# EAGLE design bbstghs (EAGLE 5.09)
POLLIN: AC-1205G; REICHELT: TASTER 3301
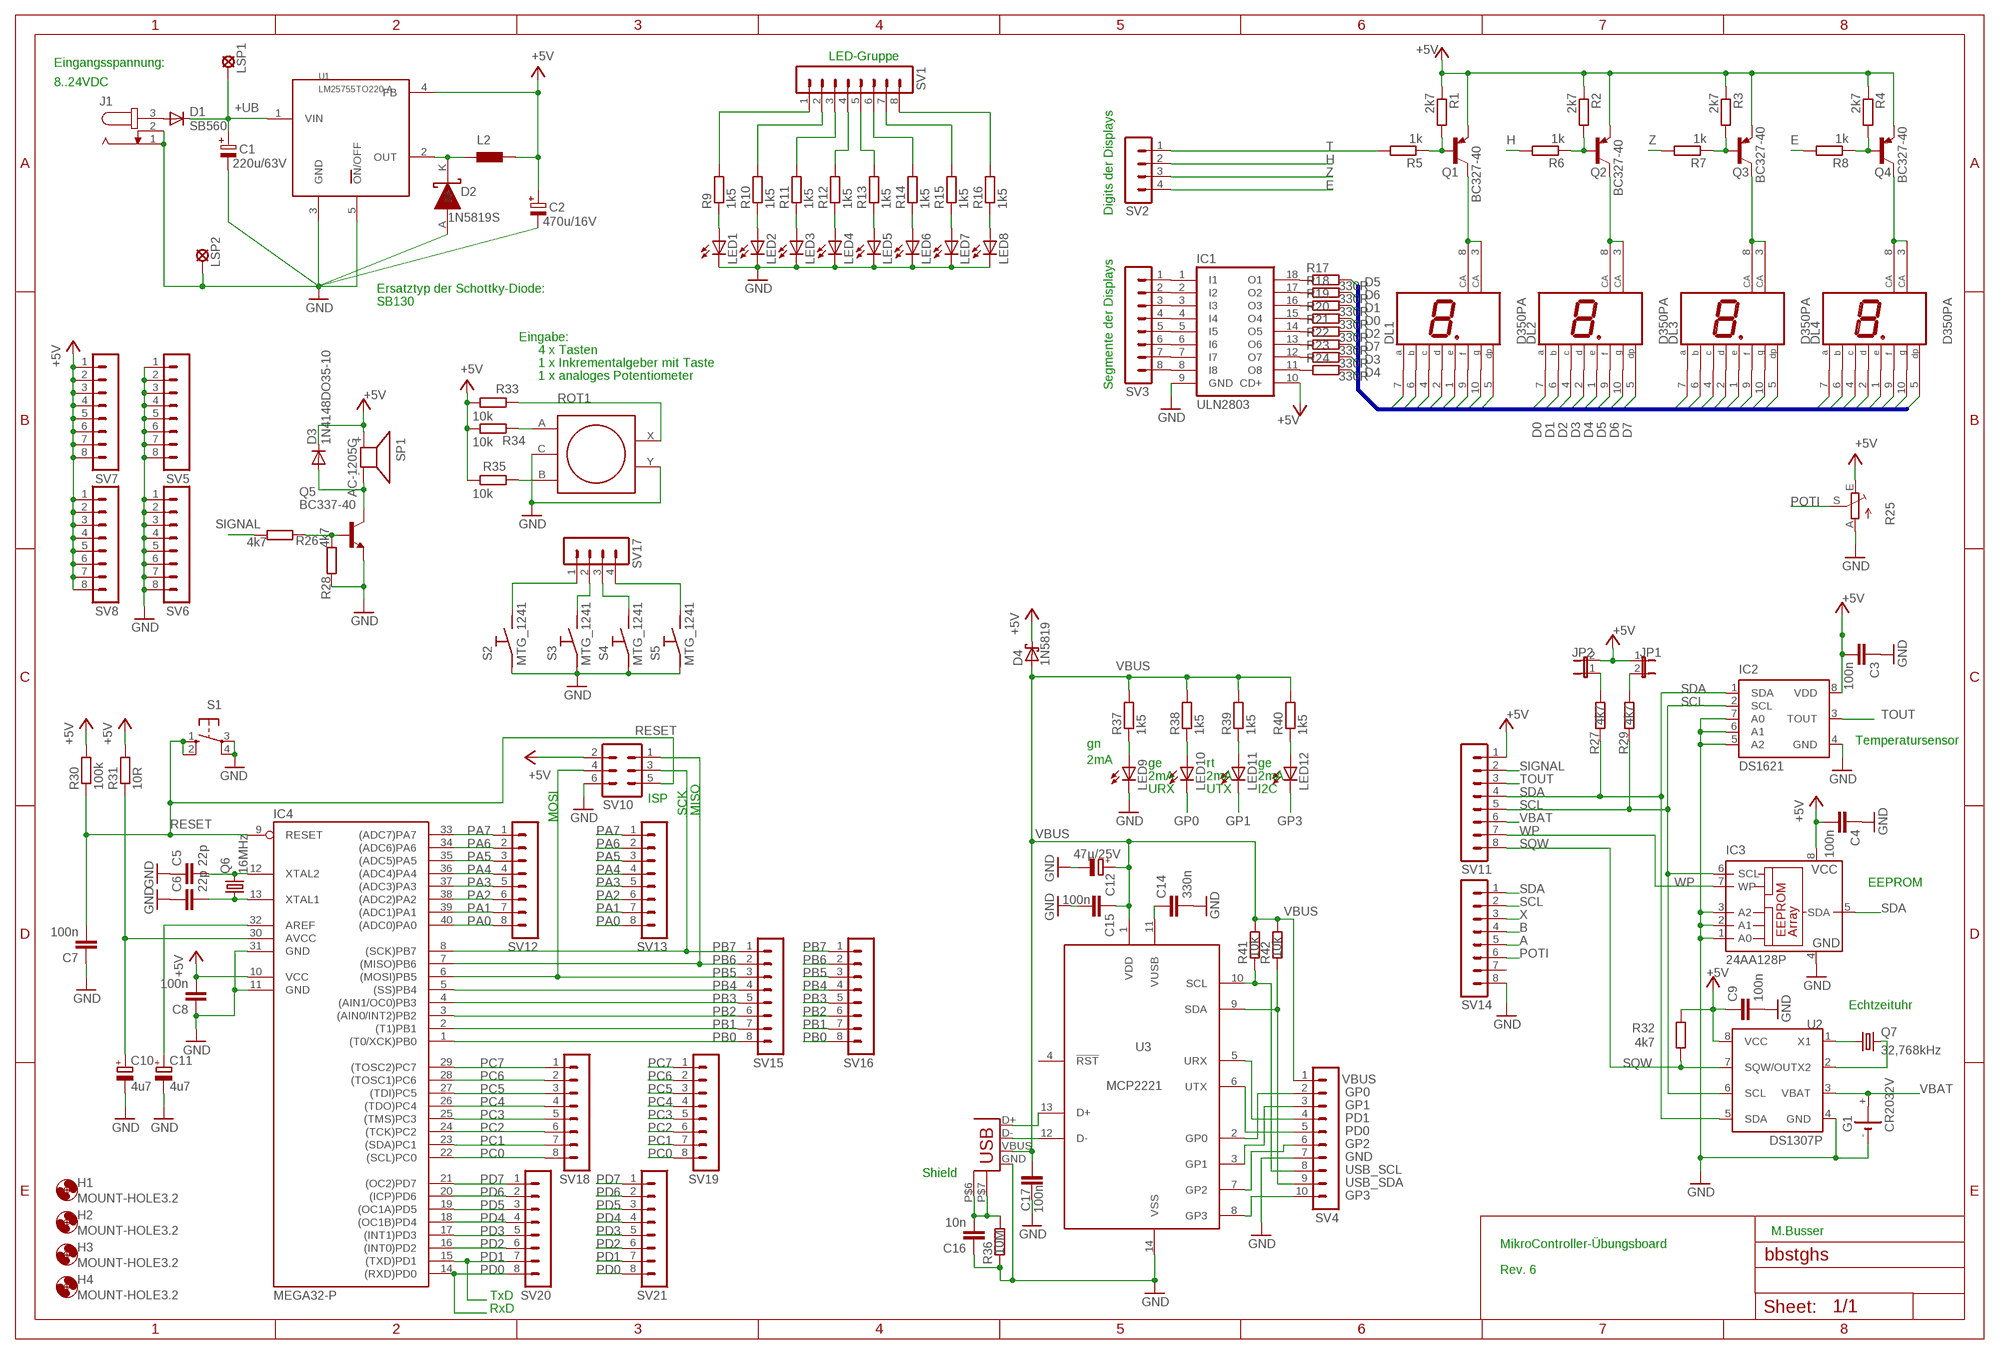
[diagram p0: schematic, sheet 1]

## Parts
C1  220u/63V  E5-10,5  [E5-10,5]
C2  470u/16V  E5-10,5  [E5-10,5]
C3  100n  C-EU050-025X075  [C050-025X075]
C4  100n  C-EU050-025X075  [C050-025X075]
C5  22p  C-EU050-025X075  [C050-025X075]
C6  22p  C-EU050-025X075  [C050-025X075]
C7  100n  C-EU050-025X075  [C050-025X075]
C8  100n  C-EU050-025X075  [C050-025X075]
C9  100n  C-EU050-025X075  [C050-025X075]
C10  4u7  CPOL-EUE2-5  [E2-5]
C11  4u7  CPOL-EUE2-5  [E2-5]
C12  47µ/25V  CPOL-EUE2-5  [E2-5]
C14  330n  C-EU050-030X075  [C050-030X075]
C15  100n  C-EU050-030X075  [C050-030X075]
C16  10n  C-EU050-030X075  [C050-030X075]
C17  100n  C-EU050-030X075  [C050-030X075]
C18  USB_SHIELED  [USB-MB-H-SHIELD]
D1  SB560  SB320  [DO201-15]
D2  1N5819S  [SOD-81]
D3  1N4148DO35-10  [DO35-10]
D4  1N5819  1N581  [DO41-10]
DL1  D350PA  [HDSP-M]
DL2  D350PA  [HDSP-M]
DL3  D350PA  [HDSP-M]
DL4  D350PA  [HDSP-M]
G1  CR2032V  [CR2032V]
H1  MOUNT-HOLE3.2  [3,2]
H2  MOUNT-HOLE3.2  [3,2]
H3  MOUNT-HOLE3.2  [3,2]
H4  MOUNT-HOLE3.2  [3,2]
IC1  ULN2803  ULN2803A  [DIL18]
IC2  DS1621  [DIL08]
IC3  24AA128P  [DIL8]
IC4  MEGA32-P  [DIL40]
J1  JACK-PLUG1  [SPC4078]
JP1  JP1E  [JP1]
JP2  JP1E  [JP1]
L2  PISR  [PISR]
LED1  LED3MM  [LED3MM]
LED2  LED3MM  [LED3MM]
LED3  LED3MM  [LED3MM]
LED4  LED3MM  [LED3MM]
LED5  LED3MM  [LED3MM]
LED6  LED3MM  [LED3MM]
LED7  LED3MM  [LED3MM]
LED8  LED3MM  [LED3MM]
LED9  LED3MM  [LED3MM]
LED10  LED3MM  [LED3MM]
LED11  LED3MM  [LED3MM]
LED12  LED3MM  [LED3MM]
LSP1  LSP10  [LSP10]
LSP2  LSP10  [LSP10]
Q1  BC327-40  [TO92-EBC]
Q2  BC327-40  [TO92-EBC]
Q3  BC327-40  [TO92-EBC]
Q4  BC327-40  [TO92-EBC]
Q5  BC337-40  [TO92]
Q6  16MHz  CRYSTALHC49U-V  [HC49U-V]
Q7  32,768kHz  CRYSTALTC26V  [TC26V]
R1  2k7  R-EU_0207/10  [0207/10]
R2  2k7  R-EU_0207/10  [0207/10]
R3  2k7  R-EU_0207/10  [0207/10]
R4  2k7  R-EU_0207/10  [0207/10]
R5  1k  R-EU_0207/10  [0207/10]
R6  1k  R-EU_0207/10  [0207/10]
R7  1k  R-EU_0207/10  [0207/10]
R8  1k  R-EU_0207/10  [0207/10]
R9  1k5  R-EU_0207/10  [0207/10]
R10  1k5  R-EU_0207/10  [0207/10]
R11  1k5  R-EU_0207/10  [0207/10]
R12  1k5  R-EU_0207/10  [0207/10]
R13  1k5  R-EU_0207/10  [0207/10]
R14  1k5  R-EU_0207/10  [0207/10]
R15  1k5  R-EU_0207/10  [0207/10]
R16  1k5  R-EU_0207/10  [0207/10]
R17  330R  R-EU_0207/10  [0207/10]
R18  330R  R-EU_0207/10  [0207/10]
R19  330R  R-EU_0207/10  [0207/10]
R20  330R  R-EU_0207/10  [0207/10]
R21  330R  R-EU_0207/10  [0207/10]
R22  330R  R-EU_0207/10  [0207/10]
R23  330R  R-EU_0207/10  [0207/10]
R24  330R  R-EU_0207/10  [0207/10]
R25  TRIM_EU-PT10  [PT-10]
R26  4k7  R-EU_0207/10  [0207/10]
R27  4k7  R-EU_0207/10  [0207/10]
R28  4k7  R-EU_0207/10  [0207/10]
R29  4k7  R-EU_0207/10  [0207/10]
R30  100k  R-EU_0207/10  [0207/10]
R31  10R  R-EU_0207/10  [0207/10]
R32  4k7  R-EU_0207/10  [0207/10]
R33  10k  R-EU_0207/10  [0207/10]
R34  10k  R-EU_0207/10  [0207/10]
R35  10k  R-EU_0207/10  [0207/10]
R36  10M  R-EU_0207/10  [0207/10]
R37  1k5  R-EU_0207/10  [0207/10]
R38  1k5  R-EU_0207/10  [0207/10]
R39  1k5  R-EU_0207/10  [0207/10]
R40  1k5  R-EU_0207/10  [0207/10]
R41  10k  R-EU_0207/10  [0207/10]
R42  10k  R-EU_0207/10  [0207/10]
ROT1  STEC12E08  [EC12E24244]
S1  10-XX  [B3F-10XX]
S2  MTG_1241  [SCHURTER_MTG]
S3  MTG_1241  [SCHURTER_MTG]
S4  MTG_1241  [SCHURTER_MTG]
S5  MTG_1241  [SCHURTER_MTG]
SP1  AC-1205G  KSS1201  [KSS1201]
SV1  MA08-1  [MA08-1]
SV2  MA04-1  [MA04-1]
SV3  MA08-1  [MA08-1]
SV4  MA10-1  [MA10-1]
SV5  MA08-1  [MA08-1]
SV6  MA08-1  [MA08-1]
SV7  MA08-1  [MA08-1]
SV8  MA08-1  [MA08-1]
SV10  ML6  [ML6]
SV11  MA08-1  [MA08-1]
SV12  MA08-1  [MA08-1]
SV13  MA08-1  [MA08-1]
SV14  MA08-1  [MA08-1]
SV15  MA08-1  [MA08-1]
SV16  MA08-1  [MA08-1]
SV17  MA04-1  [MA04-1]
SV18  MA08-1  [MA08-1]
SV19  MA08-1  [MA08-1]
SV20  MA08-1  [MA08-1]
SV21  MA08-1  [MA08-1]
U1  LM25755TO220-A  [L200]
U2  DS1307P  [DIL08]
U3  MCP2221  [DIL14]

## Nets
+5V: C2.+ C3.2 C4.2 C8.2 C9.1 D3.C D4.C IC1.10(CD+) IC2.8(VDD) IC3.8(VCC) IC4.10(VCC) JP1.1 JP2.2 L2.P$2 Q1.E Q2.E Q3.E Q4.E R1.1 R2.1 R3.1 R4.1 R25.E R30.2 R31.2 R32.2 R33.2 R34.2 R35.2 SP1.+ SV7.1 SV7.2 SV7.3 SV7.4 SV7.5 SV7.6 SV7.7 SV7.8 SV8.1 SV8.2 SV8.3 SV8.4 SV8.5 SV8.6 SV8.7 SV8.8 SV10.2 SV11.1 U1.4(FB) U2.8(VCC)
+UB: C1.+ D1.C LSP1.MP U1.1(VIN)
A: R34.1 ROT1.A SV14.5
B: R35.1 ROT1.B SV14.4
D0: DL1.7(A) DL2.7(A) DL3.7(A) DL4.7(A) R20.2
D1: DL1.6(B) DL2.6(B) DL3.6(B) DL4.6(B) R19.2
D2: DL1.4(C) DL2.4(C) DL3.4(C) DL4.4(C) R21.2
D3: DL1.2(D) DL2.2(D) DL3.2(D) DL4.2(D) R23.2
D4: DL1.1(E) DL2.1(E) DL3.1(E) DL4.1(E) R24.2
D5: DL1.9(F) DL2.9(F) DL3.9(F) DL4.9(F) R17.2
D6: DL1.10(G) DL2.10(G) DL3.10(G) DL4.10(G) R18.2
D7: DL1.5(DP) DL2.5(DP) DL3.5(DP) DL4.5(DP) R22.2
E: R8.2 SV2.4
GND: C1.- C2.- C3.1 C4.1 C5.1 C6.1 C7.1 C8.1 C9.2 C10.- C11.- C12.- C14.2 C15.2 C16.1 C17.1 C18.GND D2.A G1.- IC1.9(GND) IC2.4(GND) IC2.5(A2) IC2.6(A1) IC2.7(A0) IC3.1(A0) IC3.2(A1) IC3.3(A2) IC3.4(GND) IC4.11(GND) IC4.31(GND) J1.1 J1.2 LED1.K(C) LED2.K(C) LED3.K(C) LED4.K(C) LED5.K(C) LED6.K(C) LED7.K(C) LED8.K(C) LED9.K(C) LSP2.MP Q5.1(E) R25.A R28.1 R36.2 ROT1.C ROT1.Y S1.3(P) S1.4(P1) S2.P$1(C) S3.P$1(C) S4.P$1(C) S5.P$1(C) SV4.7 SV5.1 SV5.2 SV5.3 SV5.4 SV5.5 SV5.6 SV5.7 SV5.8 SV6.1 SV6.2 SV6.3 SV6.4 SV6.5 SV6.6 SV6.7 SV6.8 SV10.6 SV14.8 U1.3(GND) U1.5(ON/OFF) U2.4(GND) U3.14(VSS)
GP0: LED10.K(C) SV4.2 U3.2(GP0)
GP1: LED11.K(C) SV4.3 U3.3(GP1)
GP2: SV4.6 U3.7(GP2)
GP3: LED12.K(C) SV4.10 U3.8(GP3)
H: R6.2 SV2.2
N$1: C5.2 IC4.12(XTAL2) Q6.2
N$2: C6.2 IC4.13(XTAL1) Q6.1
N$3: C10.+ IC4.30(AVCC) R31.1
N$4: C11.+ IC4.32(AREF)
N$5: R14.2 SV1.6
N$6: LED1.A R9.1
N$7: LED2.A R10.1
N$8: LED3.A R11.1
N$9: LED4.A R12.1
N$10: LED5.A R13.1
N$11: LED6.A R14.1
N$12: LED7.A R15.1
N$13: LED8.A R16.1
N$14: R16.2 SV1.8
N$15: R12.2 SV1.4
N$16: R11.2 SV1.3
N$17: R10.2 SV1.2
N$18: R13.2 SV1.5
N$19: R15.2 SV1.7
N$20: R9.2 SV1.1
N$21: S2.P$2(NO) SV17.1
N$22: S5.P$2(NO) SV17.4
N$23: S4.P$2(NO) SV17.3
N$24: S3.P$2(NO) SV17.2
N$25: DL4.3(CA) DL4.8(CA) Q4.C
N$26: DL3.3(CA) DL3.8(CA) Q3.C
N$27: DL2.3(CA) DL2.8(CA) Q2.C
N$28: DL1.3(CA) DL1.8(CA) Q1.C
N$29: Q4.B R4.2 R8.1
N$30: Q3.B R3.2 R7.1
N$31: Q2.B R2.2 R6.1
N$32: Q1.B R1.2 R5.1
N$33: IC1.18(O1) R17.1
N$34: IC1.17(O2) R18.1
N$35: IC1.16(O3) R19.1
N$36: IC1.15(O4) R20.1
N$37: IC1.14(O5) R21.1
N$38: IC1.13(O6) R22.1
N$39: IC1.12(O7) R23.1
N$40: IC1.11(O8) R24.1
N$41: D3.A Q5.3(C) SP1.-
N$42: D2.K L2.P$1 U1.2(OUT)
N$43: C18.D- U3.12(D-)
N$44: C18.D+ U3.13(D+)
N$45: C14.1 U3.11(VUSB)
N$46: C16.2 C18.P$6(SHIELD1) C18.P$7(SHIELD) R36.1
N$47: IC1.1(I1) SV3.1
N$48: IC1.2(I2) SV3.2
N$49: IC1.3(I3) SV3.3
N$50: IC1.4(I4) SV3.4
N$51: LED9.A R37.1
N$52: LED10.A R38.1
N$53: LED11.A R39.1
N$54: LED12.A R40.1
N$55: IC1.5(I5) SV3.5
N$56: IC1.6(I6) SV3.6
N$57: IC1.7(I7) SV3.7
N$58: IC1.8(I8) SV3.8
N$59: JP2.1 R27.2
N$60: JP1.2 R29.2
N$61: Q7.1 U2.1(X1)
N$62: Q7.2 U2.2(X2)
N$65: Q5.2(B) R26.1 R28.2
N$88: D1.A J1.3
PA0: IC4.40((ADC0)PA0) SV12.8 SV13.8
PA1: IC4.39((ADC1)PA1) SV12.7 SV13.7
PA2: IC4.38((ADC2)PA2) SV12.6 SV13.6
PA3: IC4.37((ADC3)PA3) SV12.5 SV13.5
PA4: IC4.36((ADC4)PA4) SV12.4 SV13.4
PA5: IC4.35((ADC5)PA5) SV12.3 SV13.3
PA6: IC4.34((ADC6)PA6) SV12.2 SV13.2
PA7: IC4.33((ADC7)PA7) SV12.1 SV13.1
PB0: IC4.1((T0/XCK)PB0) SV15.8 SV16.8
PB1: IC4.2((T1)PB1) SV15.7 SV16.7
PB2: IC4.3((AIN0/INT2)PB2) SV15.6 SV16.6
PB3: IC4.4((AIN1/OC0)PB3) SV15.5 SV16.5
PB4: IC4.5((SS)PB4) SV15.4 SV16.4
PB5: IC4.6((MOSI)PB5) SV10.4 SV15.3 SV16.3
PB6: IC4.7((MISO)PB6) SV10.1 SV15.2 SV16.2
PB7: IC4.8((SCK)PB7) SV10.3 SV15.1 SV16.1
PC0: IC4.22((SCL)PC0) SV18.8 SV19.8
PC1: IC4.23((SDA)PC1) SV18.7 SV19.7
PC2: IC4.24((TCK)PC2) SV18.6 SV19.6
PC3: IC4.25((TMS)PC3) SV18.5 SV19.5
PC4: IC4.26((TDO)PC4) SV18.4 SV19.4
PC5: IC4.27((TDI)PC5) SV18.3 SV19.3
PC6: IC4.28((TOSC1)PC6) SV18.2 SV19.2
PC7: IC4.29((TOSC2)PC7) SV18.1 SV19.1
PD0: IC4.14((RXD)PD0) SV4.5 SV20.8 SV21.8 U3.6(UTX)
PD1: IC4.15((TXD)PD1) SV4.4 SV20.7 SV21.7 U3.5(URX)
PD2: IC4.16((INT0)PD2) SV20.6 SV21.6
PD3: IC4.17((INT1)PD3) SV20.5 SV21.5
PD4: IC4.18((OC1B)PD4) SV20.4 SV21.4
PD5: IC4.19((OC1A)PD5) SV20.3 SV21.3
PD6: IC4.20((ICP)PD6) SV20.2 SV21.2
PD7: IC4.21((OC2)PD7) SV20.1 SV21.1
POTI: R25.S SV14.6
RESET: C7.2 IC4.9(RESET) R30.1 S1.1(S) S1.2(S1) SV10.5
SCL: IC2.2(SCL) IC3.6(SCL) R29.1 SV11.5 SV14.2 U2.6(SCL)
SDA: IC2.1(SDA) IC3.5(SDA) R27.1 SV11.4 SV14.1 U2.5(SDA)
SIGNAL: R26.2 SV11.2
SQW: R32.1 SV11.8 U2.7(SQW/OUT)
T: R5.2 SV2.1
TOUT: IC2.3(TOUT) SV11.3
USB_SCL: R41.1 SV4.8 U3.10(SCL)
USB_SDA: R42.1 SV4.9 U3.9(SDA)
VBAT: G1.+ SV11.6 U2.3(VBAT)
VBUS: C12.+ C15.1 C17.2 C18.VBUS D4.A R37.2 R38.2 R39.2 R40.2 R41.2 R42.2 SV4.1 U3.1(VDD)
WP: IC3.7(WP) SV11.7
X: R33.1 ROT1.X SV14.3
Z: R7.2 SV2.3
Unconnected: G1.+@1(+) SV14.7 U3.4(!RST)

## Buses
B$1

## Notes on the sheet
- LED-Gruppe
- Eingangsspannung:
- 8..24VDC
- Digits der Displays
- Ersatztyp der Schottky-Diode:
- SB130
- Eingabe:
- 4 x Tasten
- 1 x Inkrementalgeber mit Taste
- 1 x analoges Potentiometer
- Segmente der Displays
- gn | Temperatursensor
- 2mA | ge | rt | ge
- 2mA | 2mA | 2mA
- URX | UTX | I2C
- ISP
- SCK | MISO
- MOSI
- EEPROM
- Echtzeituhr
- Shield
- M.Busser
- MikroController-Übungsboard
- Rev. 6
- TxD
- RxD

## Library data of the parts
C1 C2 = polcap:E5-10,5
C3-C9 C14-C17 = bbstghs:C-EU: CAPACITOR, European symbol
C10-C12 = bbstghs:CPOL-EU: POLARIZED CAPACITOR, European symbol
C18 = con-usb:USB_SHIELED
D1 = bbstghs:SB320: DIODE barrier rectifier, 3 A (Fairchild)
D2 = misc:1N5819
D3 = bbstghs:1N4148: DIODE high speed (Philips)
D4 = bbstghs:1N581*: 1.0A SCHOTTKY BARRIER RECTIFIER Source: http://www.diodes.com/datasheets/ds23001.pdf
DL1-DL4 = ibb:D350PA
G1 = battery:CR2032V: LI BATTERY Varta
H1-H4 = holes:MOUNT-HOLE: MOUNTING HOLE with drill center marker
IC1 = uln-udn:ULN2803A: DRIVER ARRAY
IC2 = maxim:DS1621: Digital Thermometer and Thermostat Source: http://pdfserv.maxim-ic.com/en/ds/DS1621.pdf
IC3 = microchip:24*: Serial EEPROM I2C
IC4 = atmel:MEGA32-P: MICROCONTROLLER 32 Kbytes FLASH 2 Kbytes SRAM 1 Kbytes EEPROM USART 8-channel 10 bit ADC Source: www.atmel.com .. doc2503.pdf
J1 = bbstghs:JACK-PLUG: DC POWER JACK Power Jack, DC, Right Angle, Through Hole, Rated 5A at 16VDC, PC Terminals Distributor: Farnell (www.Farnell.de) Drawing: 84N1161.pdf / 84N1162.pdf Manufacturer: SPC Technology (www.spctechnology.com) Type: SPC4077 / SPC 4078
JP1 JP2 = bbstghs:JP1E: JUMPER
L2 = inductor-fastron:PISR
LED1-LED12 = bbstghs:LED: LED OSRAM: - CHIPLED LG R971, LG N971, LY N971, LG Q971, LY Q971, LO R971, LY R971 LH N974, LH R974 LS Q976, LO Q976, LY Q976 LO Q996 - Hyper CHIPLED LW Q18S LB Q993, LB Q99A, LB R99A - SideLED LS A670, LO A670, LY A670, LG A670, LP A670 LB A673, LV A673, LT A673, LW A673 LH A674 LY A675 LS A676, LA A676, LO A676, LY A676, LW A676 LS A679, LY A679, LG A679 - Hyper Micro SIDELED® LS Y876, LA Y876, LO Y876, LY Y876 LT Y87S - SmartLED LW L88C, LW L88S LB L89C, LB L89S, LG L890 LS L89K, LO L89K, LY L89K LS L896, LA L896, LO L896, LY L896 - TOPLED LS T670, LO T670, LY T670, LG T670, LP T670 LSG T670, LSP T670, LSY T670, LOP T670, LYG T670 LG T671, LOG T671, LSG T671 LB T673, LV T673, LT T673, LW T673 LH T674 LS T676, LA T676, LO T676, LY T676, LB T676, LH T676, LSB T676, LW T676 LB T67C, LV T67C, LT T67C, LS T67K, LO T67K, LY T67K, LW E67C LS E67B, LA E67B, LO E67B, LY E67B, LB E67C, LV E67C, LT E67C LW T67C LS T679, LY T679, LG T679 LS T770, LO T770, LY T770, LG T770, LP T770 LB T773, LV T773, LT T773, LW T773 LH T774 LS E675, LA E675, LY E675, LS T675 LS T776, LA T776, LO T776, LY T776, LB T776 LHGB T686 LT T68C, LB T68C - Hyper Mini TOPLED® LB M676 - Mini TOPLED Santana® LG M470 LS M47K, LO M47K, LY M47K Source: http://www.osram.convergy.de LUXEON: - LUMILED® LXK2-PW12-R00, LXK2-PW12-S00, LXK2-PW14-U00, LXK2-PW14-V00 LXK2-PM12-R00, LXK2-PM12-S00, LXK2-PM14-U00 LXK2-PE12-Q00, LXK2-PE12-R00, LXK2-PE12-S00, LXK2-PE14-T00, LXK2-PE14-U00 LXK2-PB12-K00, LXK2-PB12-L00, LXK2-PB12-M00, LXK2-PB14-N00, LXK2-PB14-P00, LXK2-PB14-Q00 LXK2-PR12-L00, LXK2-PR12-M00, LXK2-PR14-Q00, LXK2-PR14-R00 LXK2-PD12-Q00, LXK2-PD12-R00, LXK2-PD12-S00 LXK2-PH12-R00, LXK2-PH12-S00 LXK2-PL12-P00, LXK2-PL12-Q00, LXK2-PL12-R00 Source: www.luxeon.com KINGBRIGHT: KA-3528ASYC Source: www.kingbright.com
LSP1 LSP2 = solpad:LSP10: SOLDER PAD drill 1.0 mm, distributor Buerklin, 12H555
Q1-Q4 = bbstghs:BC327*: PNP Transistror
Q5 = bbstghs:BC337*: NPN Transistor
Q6 Q7 = bbstghs:CRYSTAL: CRYSTAL
R1-R24 R26-R42 = bbstghs:R-EU_: RESISTOR, European symbol
R25 = bbstghs:TRIM_EU-: POTENTIOMETER
ROT1 = alps:STEC12E08
S1 = switch-omron:10-XX: OMRON SWITCH
S2-S5 = bbstghs:MTG_1241: Reichelt TASTER 1022, TASTER 1032
SP1 = bbstghs:KSS1201: SPEAKER Source: Schukat
SV1 SV3 SV5-SV8 SV11-SV16 SV18-SV21 = bbstghs:MA08-1: PIN HEADER
SV2 SV17 = bbstghs:MA04-1: PIN HEADER
SV4 = con-lstb:MA10-1: PIN HEADER
SV10 = bbstghs:ML6: HARTING
U1 = misc:LM2575
U2 = dallas:DS1307P
U3 = bbstghs:MCP2221

## Board
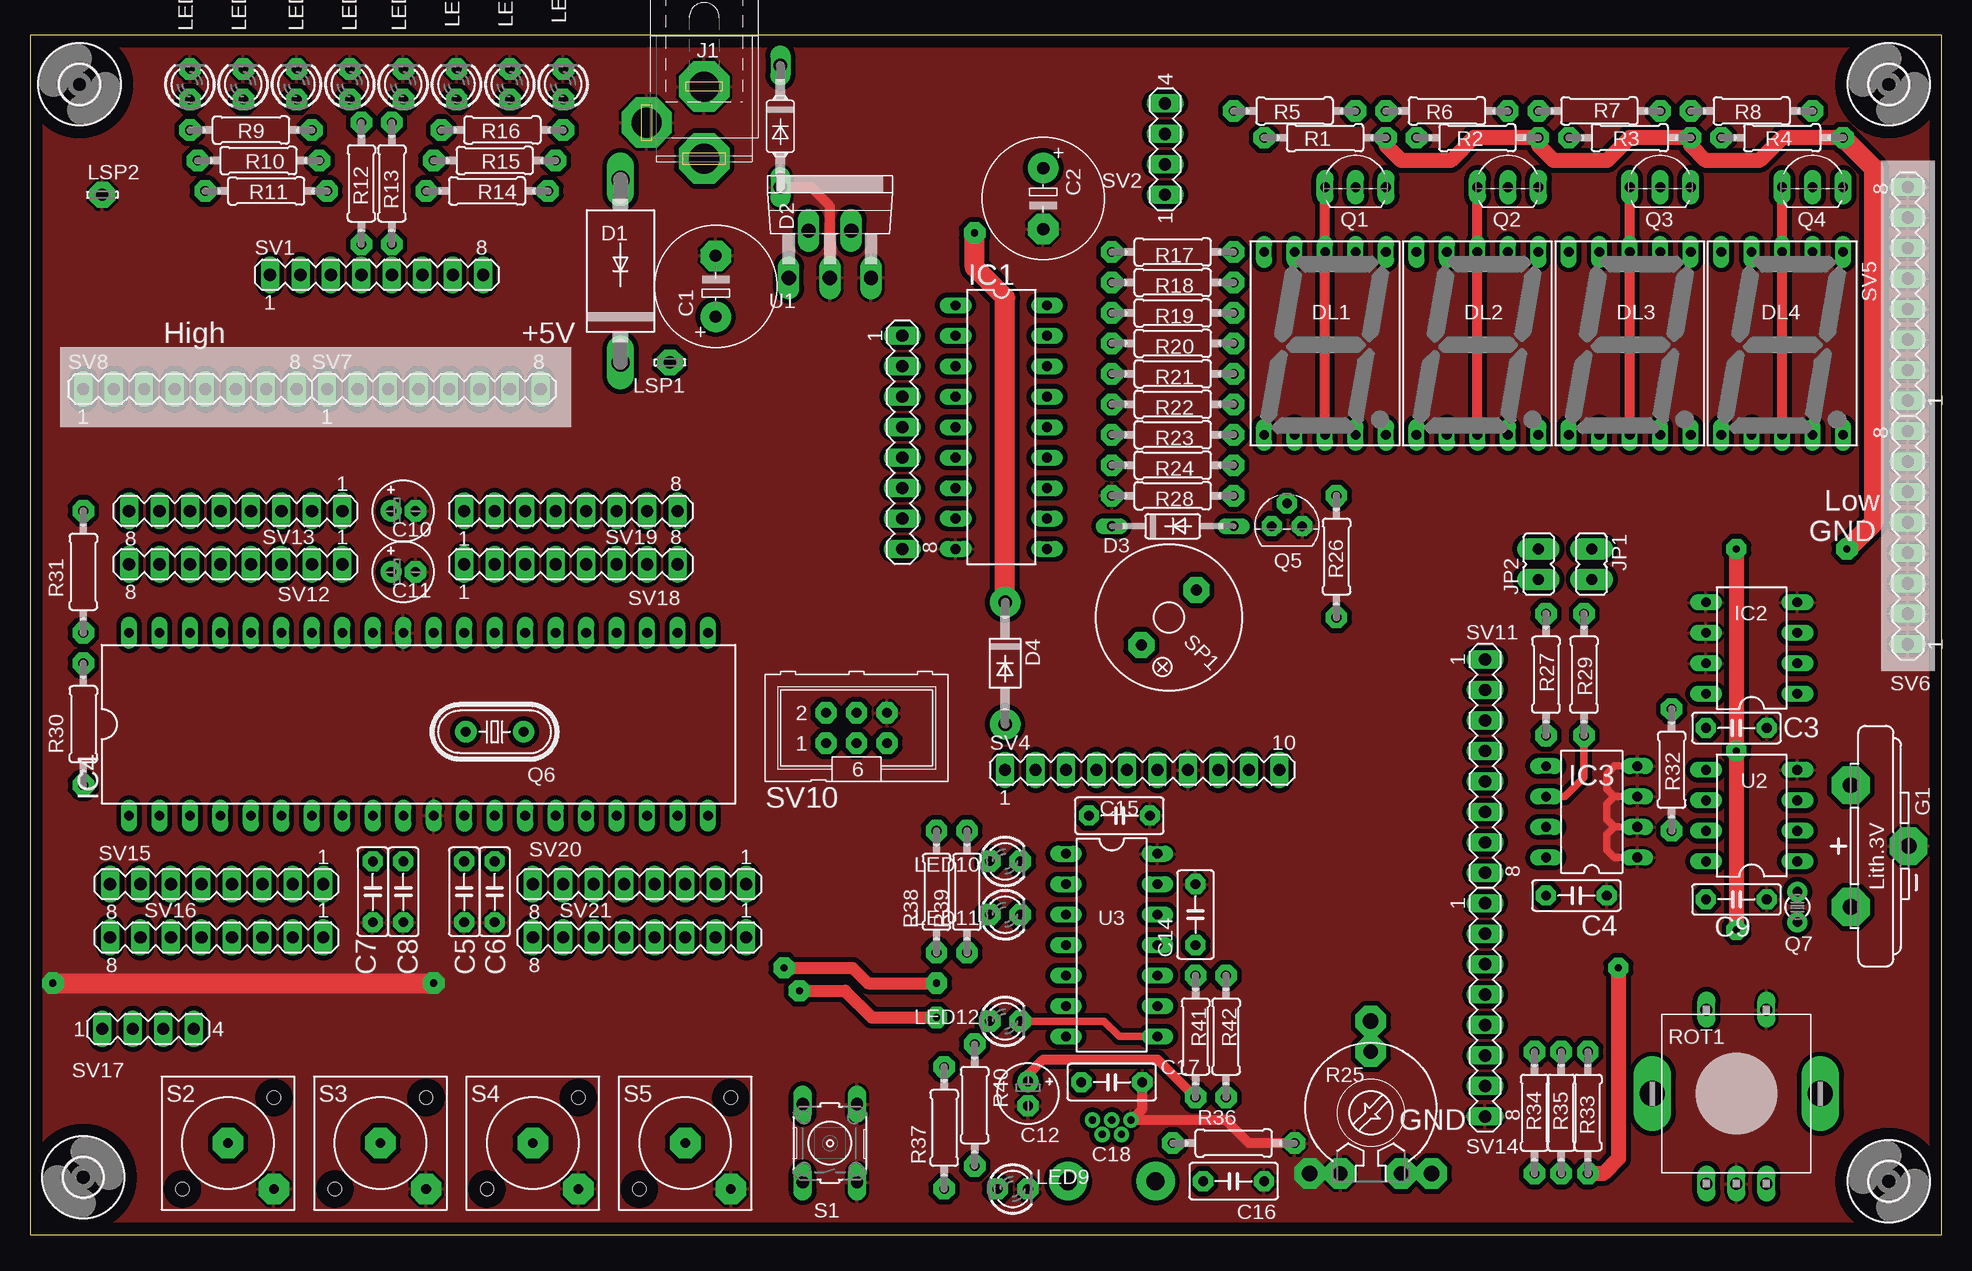
[diagram p1: board, top side]
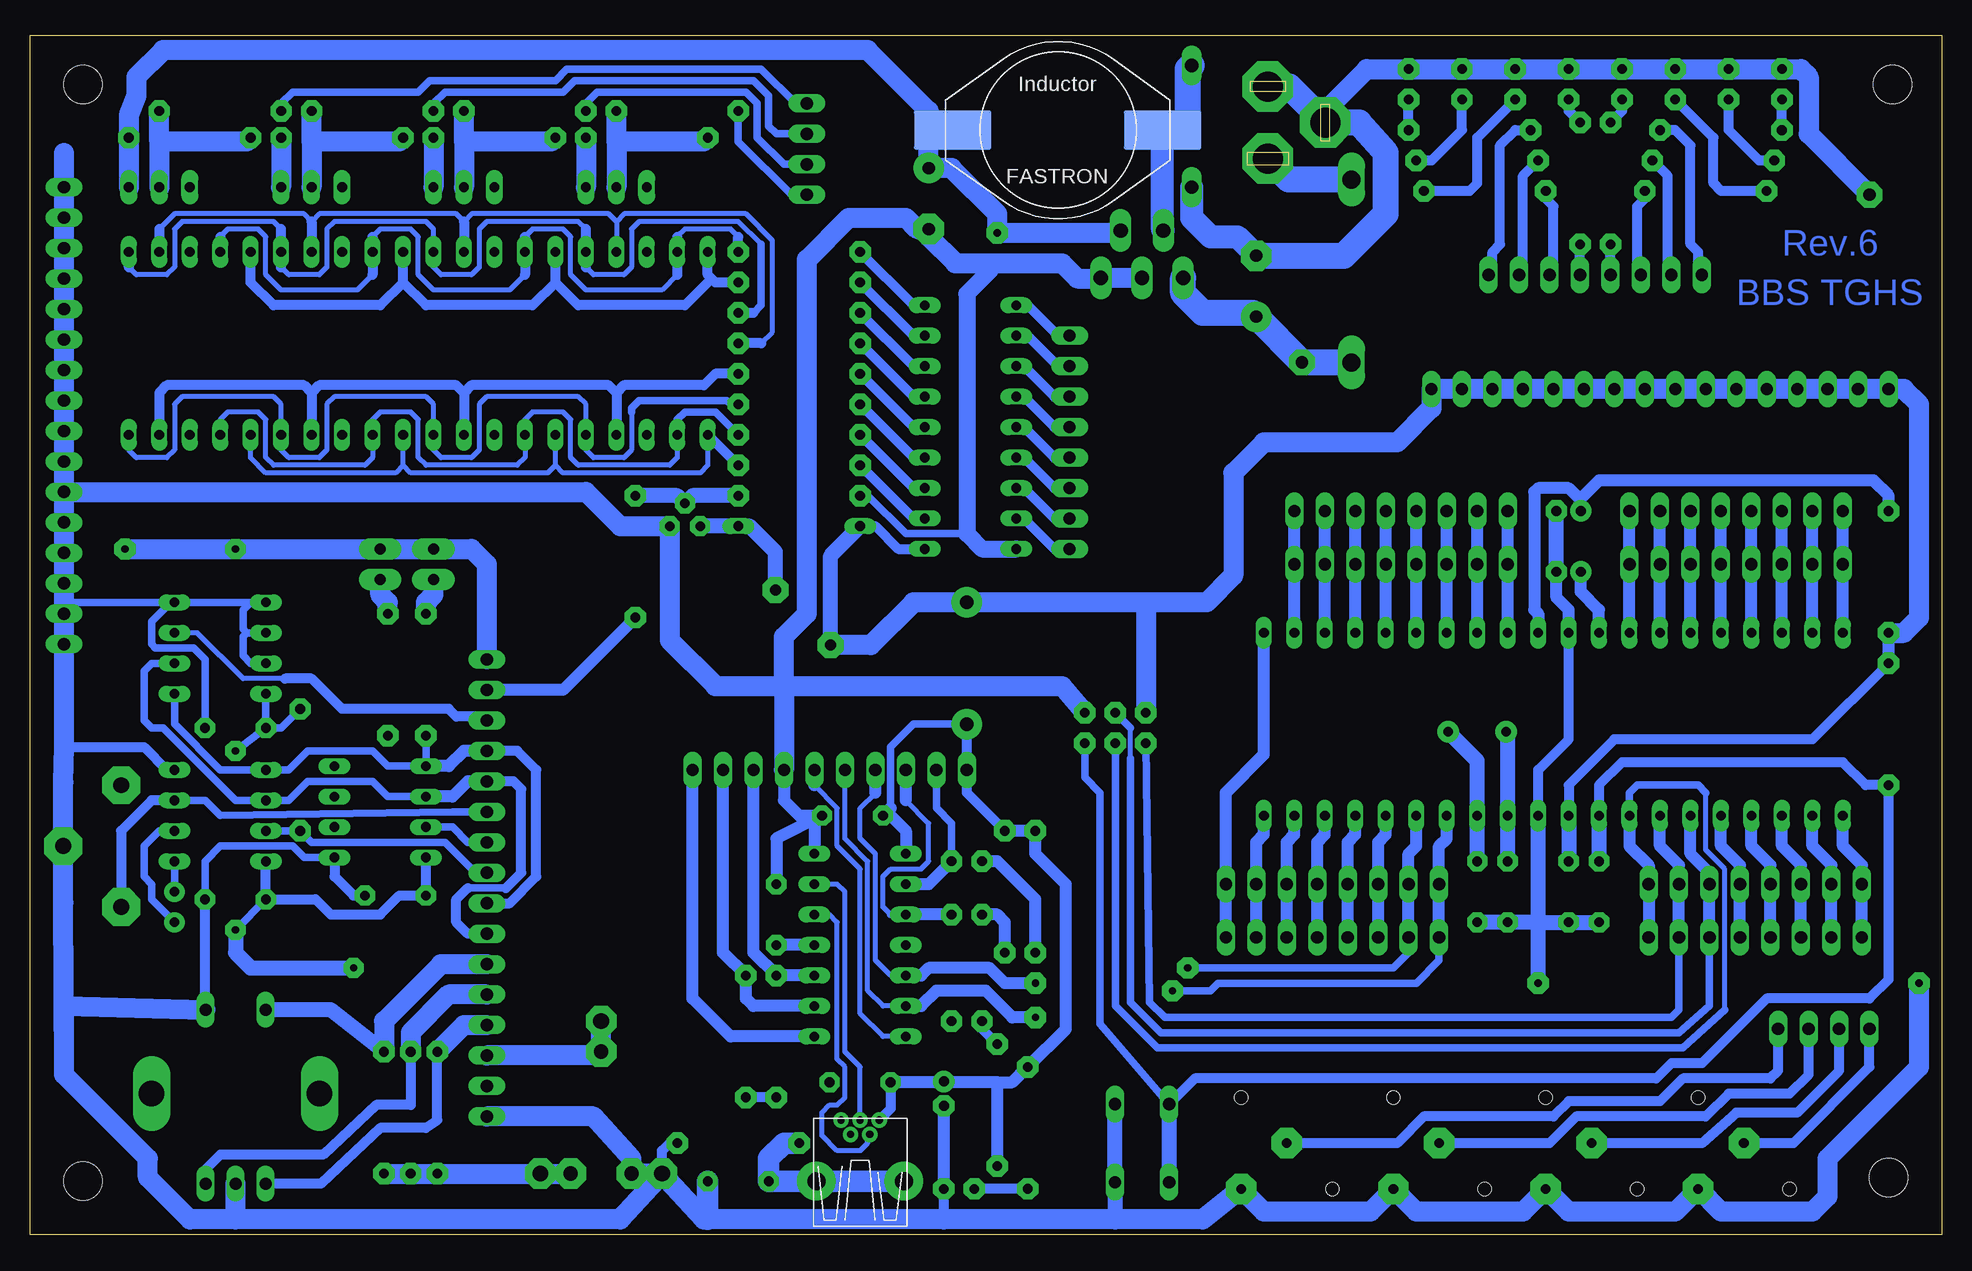
[diagram p2: board, bottom side, seen from below]

Size 159.37 x 100 mm. Coordinates in mm from the lower left corner, seen from the top.
Outline: 0,0 159.37,0 159.37,100 0,100 0,0
Copper layers (1*16): Top 0.035mm / dielectric 1.5mm / Bottom 0.035mm
Design rules "default": minimum track width 10mil, minimum drill 24mil, track to track 8mil, track to pad 8mil, pad to pad 8mil, via to via 8mil, smd to smd 8mil, copper to edge 40mil, drill to drill 8mil, minimum pad ring 10mil, minimum via ring 8mil, stop-mask expansion 4mil, vias tented up to drill 0mil, thermal gap 10mil

### Footprints (pad centres in the part's own frame; a part is rotated, then mirrored left to right if it is on the bottom)
E5-10,5 = drill 1.016 pad 2.54 round: + -2.54,0 | drill 1.016 pad 2.54 octagon: - 2.54,0
C050-025X075 = drill 0.813 pad 1.676 octagon: 1 -2.54,0; 2 2.54,0
E2-5 = drill 0.813 pad 1.778 round: + -1.016,0 | drill 0.813 pad 1.778 octagon: - 1.016,0
C050-030X075 = drill 0.813 pad 1.676 octagon: 1 -2.54,0; 2 2.54,0
USB-MB-H-SHIELD = drill 0.6 pad 1.27 round: D+ 2.56,0; D- 1.36,0.8; GND 2.56,-1.6; ID 1.36,-0.8; VBUS 2.56,1.6 | drill 1.5 pad 3.2 round: P$6 -2.54,-3.65; P$7 -2.54,3.65
DO201-15 = drill 1.499 long: A 7.62,0; C -7.62,0
SOD-81 = drill 1.118 long: A 2.54,0; K -7.62,0
DO35-10 = drill 0.813 long: A 5.08,0; C -5.08,0
DO41-10 = drill 1.118 pad 2.54 round: A 5.08,0; C -5.08,0
HDSP-M = drill 0.813 long: 1 -5.08,-7.62; 2 -2.54,-7.62; 3 0,-7.62; 4 2.54,-7.62; 5 5.08,-7.62; 6 5.08,7.62; 7 2.54,7.62; 8 0,7.62; 9 -2.54,7.62; 10 -5.08,7.62
CR2032V = drill 1.321 pad 3.15 octagon: + -2.54,-5.08; +@1 -2.54,5.08; - 2.286,0
3,2 = hole 3.2: 0,0
DIL18 = drill 0.813 long: 1 -10.16,-3.81; 2 -7.62,-3.81; 3 -5.08,-3.81; 4 -2.54,-3.81; 5 0,-3.81; 6 2.54,-3.81; 7 5.08,-3.81; 8 7.62,-3.81; 9 10.16,-3.81; 10 10.16,3.81; 11 7.62,3.81; 12 5.08,3.81; 13 2.54,3.81; 14 0,3.81; 15 -2.54,3.81; 16 -5.08,3.81; 17 -7.62,3.81; 18 -10.16,3.81
DIL08 = drill 0.813 long: 1 -3.81,-3.81; 2 -1.27,-3.81; 3 1.27,-3.81; 4 3.81,-3.81; 5 3.81,3.81; 6 1.27,3.81; 7 -1.27,3.81; 8 -3.81,3.81
DIL8 = drill 0.813 long: 1 -3.81,-3.81; 2 -1.27,-3.81; 3 1.27,-3.81; 4 3.81,-3.81; 5 3.81,3.81; 6 1.27,3.81; 7 -1.27,3.81; 8 -3.81,3.81
DIL40 = drill 0.813 long: 1 -24.13,-7.62; 2 -21.59,-7.62; 3 -19.05,-7.62; 4 -16.51,-7.62; 5 -13.97,-7.62; 6 -11.43,-7.62; 7 -8.89,-7.62; 8 -6.35,-7.62; 9 -3.81,-7.62; 10 -1.27,-7.62; 11 1.27,-7.62; 12 3.81,-7.62; 13 6.35,-7.62; 14 8.89,-7.62; 15 11.43,-7.62; 16 13.97,-7.62; 17 16.51,-7.62; 18 19.05,-7.62; 19 21.59,-7.62; 20 24.13,-7.62; 21 24.13,7.62; 22 21.59,7.62; 23 19.05,7.62; 24 16.51,7.62; 25 13.97,7.62; 26 11.43,7.62; 27 8.89,7.62; 28 6.35,7.62; 29 3.81,7.62; 30 1.27,7.62; 31 -1.27,7.62; 32 -3.81,7.62; 33 -6.35,7.62; 34 -8.89,7.62; 35 -11.43,7.62; 36 -13.97,7.62; 37 -16.51,7.62; 38 -19.05,7.62; 39 -21.59,7.62; 40 -24.13,7.62
SPC4078 = drill 2.5 pad 4.2 octagon: 1 -3,0; 2 0,-4.8; 3 3,0
JP1 = drill 0.914 pad 1.778 long: 1 0,-1.27; 2 0,1.27
PISR = smd 6.452 x 3.251: P$1 -8.7,0; P$2 8.8,0
LED3MM = drill 0.8 pad 1.778 octagon: A -1.27,0; K 1.27,0
LSP10 = drill 1.016 pad 2.159 octagon: MP 0,0
TO92-EBC = drill 0.813 pad 1.422 long: B 0,-1.27; C -2.54,-1.27; E 2.54,-1.27
TO92 = drill 0.8 pad 1.676 octagon: 1 1.27,0; 2 0,1.905; 3 -1.27,0
HC49U-V = drill 0.8 pad 1.778 round: 1 -2.413,0 | drill 0.813 pad 1.778 round: 2 2.413,0
TC26V = drill 0.8 pad 1.676 round: 1 -1.27,0; 2 1.27,0
0207/10 = drill 0.813 pad 1.778 octagon: 1 -5.08,0; 2 5.08,0
PT-10 = drill 1.2 pad 2.54 octagon: A -2.54,-5.08; E 2.54,-5.08; S 0,5.08
EC12E24244 = drill 1 long: A -2.5,-7.5; B 2.5,-7.5; C 0,-7.5; X -2.5,7; Y 2.5,7 | drill 2.1 long: CASE1 -7,0; CASE2 7,0
B3F-10XX = drill 1.016 long: 1 -3.251,2.261; 2 3.251,2.261; 3 -3.251,-2.261; 4 3.251,-2.261
SCHURTER_MTG = drill 0.8 pad 2.54 octagon: P$1 0,0; P$2 3.81,3.81 | hole 1.1: 0,7.62; 7.62,0
KSS1201 = drill 0.914 pad 2.159 octagon: + 3.251,0; - -3.251,0
MA08-1 = drill 1.016 long: 1 -8.89,0; 2 -6.35,0; 3 -3.81,0; 4 -1.27,0; 5 1.27,0; 6 3.81,0; 7 6.35,0; 8 8.89,0
MA04-1 = drill 1.016 long: 1 -3.81,0; 2 -1.27,0; 3 1.27,0; 4 3.81,0
MA10-1 = drill 1.016 long: 1 -11.43,0; 2 -8.89,0; 3 -6.35,0; 4 -3.81,0; 5 -1.27,0; 6 1.27,0; 7 3.81,0; 8 6.35,0; 9 8.89,0; 10 11.43,0
ML6 = drill 0.8 pad 1.778 octagon: 1 -2.54,-1.27; 2 -2.54,1.27; 3 0,-1.27; 4 0,1.27; 5 2.54,-1.27; 6 2.54,1.27
L200 = drill 1.194 long: 1 -3.429,-2.159; 2 -1.778,1.778; 3 0,-2.159; 4 1.778,1.778; 5 3.429,-2.159
DIL14 = drill 0.813 long: 1 -7.62,-3.81; 2 -5.08,-3.81; 3 -2.54,-3.81; 4 0,-3.81; 5 2.54,-3.81; 6 5.08,-3.81; 7 7.62,-3.81; 8 7.62,3.81; 9 5.08,3.81; 10 2.54,3.81; 11 0,3.81; 12 -2.54,3.81; 13 -5.08,3.81; 14 -7.62,3.81

### Placement (x,y rotation side)
C1  57.15,79.06 90 top
C2  84.45,86.36 270 top
C3  142.24,42.23 180 top
C4  128.91,28.26 180 top
C5  36.2,28.57 90 top
C6  38.73,28.57 90 top
C7  28.57,28.57 90 top
C8  31.11,28.57 90 top
C9  142.24,27.94 0 top
C10  31.11,60.33 0 top
C11  31.11,55.24 0 top
C12  83.19,11.75 270 top
C14  97.16,26.67 90 top
C15  90.81,34.92 0 top
C16  100.33,4.45 180 top
C17  90.17,12.7 180 top
C18  90.17,6.99 90 top
D1  49.21,80.33 90 top
D2  62.55,89.85 270 top
D3  95.25,59.05 0 top
D4  81.28,47.62 270 top
DL1  107.95,74.3 0 top
DL2  120.65,74.3 0 top
DL3  133.35,74.3 0 top
DL4  146.05,74.3 0 top
G1  154.31,32.38 0 top
H1  4.13,95.89 90 top
H2  154.94,95.89 90 top
H3  154.94,4.45 90 top
H4  4.45,4.76 0 top
IC1  80.96,67.31 270 top
IC2  143.51,48.9 90 top
IC3  130.18,35.24 90 top
IC4  32.38,42.55 0 top
J1  56.2,92.71 270 top
JP1  130.18,55.88 180 top
JP2  125.73,55.88 0 top
L2  73.66,92.08 180 bottom
LED1  13.34,95.89 90 top
LED2  17.78,95.89 90 top
LED3  22.23,95.89 90 top
LED4  26.67,95.89 90 top
LED5  31.11,95.89 90 top
LED6  35.56,95.89 90 top
LED7  40.01,95.89 90 top
LED8  44.45,95.89 90 top
LED9  81.92,3.81 0 top
LED10  81.28,31.11 0 top
LED11  81.28,26.67 0 top
LED12  81.28,17.78 0 top
LSP1  53.34,72.71 180 top
LSP2  6.03,86.68 0 top
Q1  110.49,88.58 0 top
Q2  123.19,88.58 0 top
Q3  135.89,88.58 0 top
Q4  148.59,88.58 0 top
Q5  104.78,59.05 0 top
Q6  38.73,41.91 180 top
Q7  147.32,27.3 270 top
R1  107.95,91.44 180 top
R2  120.65,91.44 180 top
R3  133.35,91.44 180 top
R4  146.05,91.44 180 top
R5  105.41,93.66 180 top
R6  118.11,93.66 180 top
R7  130.81,93.66 180 top
R8  143.51,93.66 180 top
R9  18.41,92.08 0 top
R10  19.05,89.53 0 top
R11  19.68,87 0 top
R12  27.62,87.63 270 top
R13  30.16,87.63 270 top
R14  38.1,87 180 top
R15  38.73,89.53 180 top
R16  39.37,92.08 180 top
R17  95.25,81.92 0 top
R18  95.25,79.38 0 top
R19  95.25,76.83 0 top
R20  95.25,74.3 0 top
R21  95.25,71.75 0 top
R22  95.25,69.22 0 top
R23  95.25,66.67 0 top
R24  95.25,64.14 0 top
R25  111.76,10.16 0 top
R26  108.9,56.52 270 top
R27  126.36,46.67 90 top
R28  95.25,61.59 0 top
R29  129.54,46.67 90 top
R30  4.45,42.55 90 top
R31  4.45,55.24 270 top
R32  136.84,38.73 90 top
R33  129.86,10.16 270 top
R34  125.41,10.16 270 top
R35  127.64,10.16 270 top
R36  100.33,7.62 0 top
R37  76.2,8.89 90 top
R38  75.56,28.57 90 top
R39  78.11,28.57 90 top
R40  78.74,10.79 270 top
R41  97.16,16.51 270 top
R42  99.69,16.51 270 top
ROT1  142.24,11.75 0 top
S1  66.67,7.62 90 top
S2  20.32,3.81 90 top
S3  33.02,3.81 90 top
S4  45.72,3.81 90 top
S5  58.42,3.81 90 top
SP1  94.93,51.44 225 top
SV1  28.89,80.01 0 top
SV2  94.61,90.49 90 top
SV3  72.71,66.04 270 top
SV4  92.71,38.73 0 top
SV5  156.53,78.42 90 top
SV6  156.53,58.1 90 top
SV7  33.66,70.48 0 top
SV8  13.34,70.48 0 top
SV10  68.9,42.23 0 top
SV11  121.28,39.05 270 top
SV12  17.14,55.88 180 top
SV13  17.14,60.33 180 top
SV14  121.28,18.73 270 top
SV15  15.56,29.21 180 top
SV16  15.56,24.77 180 top
SV17  9.84,17.14 0 top
SV18  45.09,55.88 0 top
SV19  45.09,60.33 0 top
SV20  50.8,29.21 180 top
SV21  50.8,24.77 180 top
U1  66.67,81.92 0 top
U2  143.51,34.92 90 top
U3  90.17,24.13 270 top

### Tracks (layer width: path | path; a pad name or v marks a point on that pad's centre or on a via)
+5V  (via drill 0.6 pad 1.68, 0.6 pad 1.78)
  Top 1.27: R4.1 146.05,91.44 144.15,89.53 139.7,89.53 138.43,90.81 R3.1 133.35,91.44 131.44,89.53 127,89.53 125.73,90.81 R2.1 120.33,91.44 118.43,89.53 114.3,89.53 113.03,90.81 R1.1 | v142.24,25.4 v142.24,40.32 v142.24,57.15 | v132.4,22.23 132.4,6.35 131.13,5.08 R33.2
  Top 1.676: R4.1 153.67,88.9 153.67,59.37 v151.45,57.15 | D4.C 81.28,78.11 78.74,80.64 v78.74,83.5
  Bottom 0.61: C3.2 IC2.8 | v142.24,40.32 C3.2 | v142.24,25.4 C9.1 | R32.2 138.43,42.23 C3.2
  Bottom 0.813: U2.8 C9.1 135.57,27.94 134.3,26.67 130.18,26.67 128.59,28.26 C4.2 IC3.8 | R30.2 10.79,41.27 27.3,41.27 31.11,37.47 IC4.10 | IC1.10 87,57.15 88.9,59.05 D3.C
  Bottom 1.016: R30.2 R31.2
  Bottom 1.27: IC4.10 C8.2 | v132.4,22.23 140.97,22.23 142.24,23.5 v142.24,25.4 | D3.C 92.63,56.59 SP1.+
  Bottom 1.676: R31.2 3.17,50.16 1.91,51.44 1.91,69.22 3.17,70.48 SV8.1 SV8.2 SV8.3 SV8.4 SV8.5 SV8.6 SV8.7 SV8.8 SV7.1 SV7.2 SV7.3 SV7.4 SV7.5 SV7.6 SV7.7 SV7.8 42.55,68.9 45.4,66.04 56.52,66.04 59.05,63.5 59.05,54.93 61.28,52.7 66.36,52.7 | R25.E R34.2 R35.2 R33.2 | 66.36,52.7 SV10.2 | R1.1 Q1.E | R2.1 Q2.E | R3.1 Q3.E | Q4.E R4.1 151.13,93.34 150.5,94.93 150.5,96.52 148.27,98.74 89.53,98.74 84.45,93.66 84.45,92.39 | SP1.+ 89.29,49.14 85.72,52.7 D4.C 66.36,52.7 | v151.45,57.15 v142.24,57.15 JP1.1 JP2.2 122.56,57.15 121.28,55.88 SV11.1 | 84.45,92.39 C2.+ 82.55,88.9 78.74,85.09 v78.74,83.5 68.64,83.5 U1.4 | L2.P$2 82.78,92.39 84.45,92.39
+UB
  Bottom 2.184: D1.C LSP1.MP C1.+ 57.47,76.83 61.59,76.83 63.25,78.49 U1.1
A
  Bottom 0.813: R34.1 125.41,9.53 126.36,8.89 130.18,8.89 135.13,4.25 ROT1.A
  Bottom 1.676: SV14.5 123.19,17.46 R34.1
B
  Bottom 0.813: ROT1.B 144.74,5.44 143.51,6.67 134.94,6.67 130.49,10.79 127.64,10.79 R35.1
  Bottom 1.676: SV14.4 124.46,20 127.64,16.83 R35.1
D0
  Bottom 0.406: 148.59,83.82 147.32,85.09 136.53,85.09 135.89,84.45 135.25,85.09 123.83,85.09 123.19,84.45 122.56,85.09 111.12,85.09 110.49,84.45 | 110.49,84.45 DL1.7 | 110.49,84.45 109.86,85.09 99.69,85.09 97.47,82.87 97.47,75.25 98.42,74.3
  Bottom 0.813: 148.59,83.82 DL4.7 | 135.89,84.45 DL3.7 | 123.19,84.45 DL2.7 | 98.42,74.3 R20.2
D1
  Bottom 0.406: 151.13,80.64 150.5,80.01 147.96,80.01 147.32,80.64 147.32,83.82 146.69,84.45 139.06,84.45 138.43,83.82 | 138.43,80.64 137.79,80.01 135.25,80.01 134.62,80.64 134.62,83.82 133.99,84.45 126.36,84.45 125.73,83.82 DL2.6 125.73,80.64 125.09,80.01 122.56,80.01 121.92,80.64 121.92,83.82 121.28,84.45 113.67,84.45 113.03,83.82 | 113.03,80.64 112.39,80.01 109.86,80.01 109.22,80.64 109.22,83.82 108.58,84.45 100.33,84.45 98.42,82.55
  Bottom 0.61: 98.42,82.55 98.42,77.47 99.06,76.83
  Bottom 0.813: 151.13,80.64 DL4.6 | 138.43,83.82 DL3.6 138.43,80.64 | 113.03,83.82 DL1.6 113.03,80.64 | 99.06,76.83 R19.2
D2
  Bottom 0.813: DL4.4 148.59,70.17 147.96,70.8 136.53,70.8 135.89,70.17 | 135.89,70.17 DL3.4 | 135.89,70.17 135.25,70.8 123.83,70.8 123.19,70.17 | 123.19,70.17 DL2.4 | 123.19,70.17 122.56,70.8 111.12,70.8 110.49,70.17 | 110.49,70.17 DL1.4 | 110.49,70.17 109.86,70.8 103.19,70.8 102.23,71.75 R21.2
D3
  Bottom 0.406: DL4.2 143.51,67.94 142.88,68.58 140.34,68.58 139.7,67.94 139.7,64.77 139.06,64.14 131.44,64.14 130.81,64.77 DL3.2 130.81,67.94 130.18,68.58 127.64,68.58 127,67.94 127,64.77 126.36,64.14 118.75,64.14 118.11,64.77 DL2.2 118.11,67.94 117.47,68.58 114.94,68.58 114.3,67.94 114.3,64.77 113.67,64.14 106.05,64.14 105.41,64.77 DL1.2
  Bottom 0.61: R23.2 102.23,68.58 104.78,68.58 105.41,67.94 DL1.2
D4
  Bottom 0.406: DL4.1 140.97,64.77 139.7,63.5 128.91,63.5 128.27,64.14 | 128.27,64.14 DL3.1 | 128.27,64.14 127.64,63.5 116.2,63.5 115.57,64.14 | 115.57,64.14 DL2.1 | 115.57,64.14 114.94,63.5 103.5,63.5 102.87,64.14 DL1.1
  Bottom 0.813: R24.2 DL1.1
D5
  Bottom 0.406: 143.51,83.19 142.88,83.82 140.34,83.82 139.7,83.19 139.7,80.01 138.43,78.74 132.08,78.74 130.81,80.01 | 130.81,83.19 130.18,83.82 127.64,83.82 127,83.19 127,80.01 125.73,78.74 119.38,78.74 118.11,80.01 | 118.11,83.19 117.47,83.82 114.94,83.82 114.3,83.19 114.3,80.01 113.03,78.74 106.68,78.74 105.41,80.01 | 105.41,83.19 104.78,83.82 100.97,83.82 100.33,83.19
  Bottom 0.813: 143.51,83.19 DL4.9 | 130.81,80.01 DL3.9 130.81,83.19 | 118.11,80.01 DL2.9 118.11,83.19 | 105.41,80.01 DL1.9 105.41,83.19 | R17.2 100.33,83.19
D6
  Bottom 0.406: DL1.10 102.87,79.38
  Bottom 0.813: DL4.10 140.97,79.38 139.06,77.47 130.18,77.47 128.27,79.38 | 128.27,79.38 DL3.10 | 128.27,79.38 126.36,77.47 117.47,77.47 115.57,79.38 | 115.57,79.38 DL2.10 | 115.57,79.38 113.67,77.47 104.78,77.47 102.87,79.38 | R18.2 102.23,79.38 102.87,80.01 DL1.10
D7
  Bottom 0.406: DL4.5 151.13,65.41 150.5,64.77 147.96,64.77 147.32,65.41 147.32,69.22 146.69,69.85 139.06,69.85 138.43,69.22 DL3.5 138.43,65.41 137.79,64.77 135.25,64.77 134.62,65.41 134.62,69.22 133.99,69.85 126.36,69.85 125.73,69.22 DL2.5 125.73,65.41 125.09,64.77 122.56,64.77 121.92,65.41 121.92,69.22 121.28,69.85 113.67,69.85 113.03,69.22 DL1.5 113.03,65.41 112.39,64.77 109.86,64.77 109.22,65.41 109.22,68.58
  Bottom 0.61: R22.2 100.97,69.22 101.28,69.53 108.58,69.53 109.22,68.9 109.22,68.58
E
  Bottom 0.61: SV2.4 95.57,94.3 98.42,97.16 114.62,97.16 115.57,96.2 126.05,96.2 127,95.25 137.48,95.25 138.43,94.3 R8.2
GND  (via drill 0.6 pad 1.78, 1.3 pad 2.54)
  Top 0.61: 132.08,36.51 131.44,37.15 131.44,38.42 132.08,39.05 IC3.4 | 132.08,36.51 IC3.3 | 132.08,36.51 131.44,35.88 131.44,34.61 132.08,33.97 | 132.08,33.97 IC3.2 | 132.08,33.97 131.44,33.34 131.44,32.07 132.08,31.43 IC3.1
  Top 0.813: 91.79,9.53 C18.GND | 91.79,9.53 99.69,9.53 101.6,7.62 R36.2 | 91.79,9.53 92.71,10.45 C17.1 | U1.3 66.67,85.72 65.09,87.31 D2.A
  Top 1.676: v1.91,20.95 v33.66,20.95
  Bottom 0.406: ROT1.Y 144.78,18.79 | C15.2 93.98,34.29
  Bottom 0.61: IC2.4 IC2.5 140.97,52.7 141.6,52.07 141.6,50.48 141.29,50.16 | 156.53,52.7 IC2.4 | C3.1 144.78,47.94 145.73,48.9 148.91,48.9 149.22,49.21 149.22,51.12 147.64,52.7 IC2.4 | IC2.7 140.97,47.62 141.6,48.26 141.6,49.85 141.29,50.16 | 141.29,50.16 IC2.6 | IC3.1 136.53,31.43 137.48,32.38 143.51,32.38 144.78,31.11 C9.2 | R28.1 89.53,61.59 86.36,58.42 81.28,58.42 | 68.9,5.28 S1.3 68.94,5.44
  Bottom 0.813: U2.4 147.96,38.73 149.86,40.64 156.53,40.64 | IC4.31 31.11,41.27 33.66,38.73 IC4.11 | 144.78,18.79 C9.2 | C4.1 132.4,28.26 133.99,29.84 IC3.1 | v106.68,5.08 106.68,6.99 106.05,7.62 R36.2 | 83.19,1.27 LED9.K | 79.38,80.96 79.38,80.33
  Bottom 1.016: IC4.31 31.11,52.07 32.13,53.09 C11.- | LED9.K C12.- | SV4.7 96.52,36.2 95.25,34.92 C15.2 97.16,33.02 C14.2 | 93.98,34.29 U3.14
  Bottom 1.27: C7.1 C8.1 33.66,26.04 | 33.66,26.04 C5.1 C6.1 | 33.66,26.04 IC4.11 | S1.3 S1.4 | 68.9,1.27 68.9,5.28 | C11.- C10.- | v33.66,20.95 33.66,26.04
  Bottom 1.422: IC1.9 80.01,57.15 81.28,58.42 81.28,78.42 79.38,80.33
  Bottom 1.676: 156.53,13.34 156.59,27.69 G1.- 156.59,37.72 156.53,40.64 SV6.1 SV6.2 156.53,52.7 SV6.3 SV6.4 SV6.5 SV6.6 | SV6.6 SV6.7 SV6.8 SV5.1 SV5.2 SV5.3 SV5.4 SV5.5 SV5.6 SV5.7 SV5.8 156.53,90.17 | 156.53,13.34 156.53,19.05 156.51,19.07 ROT1.Y | v106.68,5.08 103.19,1.27 102.87,1.27 83.19,1.27 68.9,1.27 61.59,1.27 S5.P$1 56.52,1.91 47.62,1.91 S4.P$1 43.81,1.91 34.92,1.91 S3.P$1 31.11,1.91 22.23,1.91 S2.P$1 18.41,1.91 10.79,1.91 9.53,3.17 9.53,6.35 1.91,13.97 v1.91,20.95 | v106.68,5.08 R25.A 109.22,6.35 112.39,9.84 SV14.8 | J1.2 51.4,93.7 47.94,97.16 LED8.K LED7.K LED6.K LED5.K LED4.K LED3.K LED2.K LED1.K 11.75,97.16 11.11,96.52 11.11,91.76 LSP2.MP | U1.3 U1.5 70.17,79.69 72.07,79.69 73.34,80.96 79.38,80.96 82.23,80.96 84.45,83.19 C2.- 85.41,83.82 86.36,84.77 91.12,84.77 94.61,81.28 94.61,51.75 96.52,49.85 96.52,45.72 | v106.68,5.08 110.17,1.27 142.24,1.27 | 142.24,1.27 146.05,1.27 149.54,4.76 149.54,6.35 156.53,13.34 | 142.24,1.27 ROT1.C | SV10.6 73.34,45.72 96.52,45.72 | 96.52,45.72 SV4.7 | 96.52,45.72 102.23,45.72 106.05,49.53 Q5.1 110.17,59.05 113.03,61.91 SV6.6 | D2.A 62.55,87
  Bottom 1.778: 102.87,1.27 C16.1
  Bottom 1.93: C1.- 58.74,83.19 60.96,83.19 62.55,84.77 D2.A
  Bottom 2.184: J1.1 54.4,95.71 J1.2 48.58,92.71 46.35,90.17 46.35,85.09 49.85,81.6 C1.-
  pour Top (isolate 0.406): -0.32,100.33 -0.32,-0.32 8.57,-0.32 159.7,-0.32 159.7,4.76 159.7,100.33 150.5,100.33
GP0
  Bottom 0.61: LED10.K 82.55,34.29 83.82,35.56 SV4.2
  Bottom 1.016: U3.2 84.45,29.21 LED10.K
GP1
  Bottom 0.406: 87.63,26.67 88.27,27.3 88.27,29.84 87.63,30.48 85.09,30.48 84.45,31.11 84.45,34.29 86.36,36.2
  Bottom 0.61: U3.3 87.63,26.67
  Bottom 1.016: LED11.K U3.3 | 86.36,36.2 SV4.3
GP2
  Bottom 0.406: U3.7 88.27,16.51 90.17,18.41 90.17,30.48 92.08,32.38 92.08,35.56 93.98,37.47
  Bottom 1.016: 93.98,37.47 SV4.6
GP3
  Top 0.61: LED12.K 89.53,17.78 90.81,16.51 U3.8
  Bottom 1.016: U3.8 100.97,16.51 104.14,19.68 SV4.10
H
  Bottom 0.61: SV2.2 96.52,89.22 98.74,91.44 98.74,94.3 99.69,95.25 112.08,95.25 113.03,94.3 R6.2
N$1
  Bottom 0.813: 36.2,41.78 Q6.2
  Bottom 1.27: 36.2,41.78 IC4.12 C5.2
N$2
  Bottom 1.27: Q6.1 38.73,39.5 IC4.13 C6.2
N$3
  Bottom 0.813: 30.16,61.28 C10.+
  Bottom 1.016: R31.1 4.45,61.59 5.71,62.87 28.57,62.87 30.16,61.28 | IC4.30 33.66,51.75 33.97,52.07 33.97,61.91 33.66,62.23 31.11,62.23 30.1,61.21 C10.+
N$4
  Bottom 1.016: IC4.32 28.57,52.07 30.1,53.59 C11.+
N$5
  Bottom 0.813: SV1.6 32.38,80.33 32.38,85.72 33.02,86.36 R14.2
N$6
  Bottom 0.813: R9.1 LED1.A
N$7
  Bottom 0.813: LED2.A 17.78,92.08 15.24,89.53 R10.1
N$8
  Bottom 0.813: LED3.A 19.05,91.44 19.05,87.63 18.41,87 R11.1
N$9
  Bottom 0.813: R12.1 26.67,93.66 LED4.A
N$10
  Bottom 0.813: R13.1 31.11,93.66 LED5.A
N$11
  Bottom 0.813: LED6.A 38.73,91.44 38.73,87.63 39.37,87 R14.1
N$12
  Bottom 0.813: LED7.A 40.01,92.08 42.55,89.53 R15.1
N$13
  Bottom 0.813: R16.1 LED8.A
N$14
  Bottom 0.813: SV1.8 37.47,80.33 37.47,81.92 36.83,82.55 36.83,90.81 35.56,92.08 R16.2
N$15
  Bottom 0.813: SV1.4 R12.2
N$16
  Bottom 0.813: SV1.3 25.4,80.33 25.4,85.72 24.77,86.36 R11.2
N$17
  Bottom 0.813: SV1.2 22.86,80.33 22.86,88.27 R10.2
N$18
  Bottom 0.813: SV1.5 R13.2
N$19
  Bottom 0.813: SV1.7 34.92,80.33 34.92,88.27 R15.2
N$20
  Bottom 0.813: SV1.1 20.32,80.33 20.32,81.92 20.95,82.55 20.95,90.81 22.23,92.08 R9.2
N$21
  Bottom 0.813: SV17.1 6.03,13.97 12.38,7.62 S2.P$2
N$22
  Bottom 0.813: SV17.4 13.65,13.65 14.29,13.02 21.59,13.02 23.5,11.11 31.11,11.11 32.38,9.84 43.18,9.84 45.4,7.62 S5.P$2
N$23
  Bottom 0.813: SV17.3 11.11,13.34 12.7,11.75 17.78,11.75 19.68,9.84 30.48,9.84 32.7,7.62 S4.P$2
N$24
  Bottom 0.813: SV17.2 8.57,13.65 12.06,10.16 17.14,10.16 20,7.62 S3.P$2
N$25
  Top 0.813: DL4.3 DL4.8 Q4.C
N$26
  Top 0.813: DL3.3 DL3.8 Q3.C
N$27
  Top 0.813: DL2.3 DL2.8 Q2.C
N$28
  Top 0.813: DL1.3 DL1.8 Q1.C
N$29
  Bottom 1.676: 148.59,91.12 Q4.B | 148.59,91.12 R8.1 | R4.2 141.29,91.12 148.59,91.12
N$30
  Bottom 1.676: 135.89,91.12 Q3.B | 135.89,91.12 R7.1 | R3.2 128.59,91.12 135.89,91.12
N$31
  Bottom 1.676: 123.19,91.12 Q2.B | 123.19,91.12 R6.1 | R2.2 115.89,91.12 123.19,91.12
N$32
  Bottom 1.676: 110.49,91.12 Q1.B | 110.49,91.12 R5.1 | R1.2 103.19,91.12 110.49,91.12
N$33
  Bottom 0.813: IC1.18 85.72,77.47 R17.1
N$34
  Bottom 0.813: IC1.17 85.72,74.93 R18.1
N$35
  Bottom 0.813: IC1.16 85.72,72.39 R19.1
N$36
  Bottom 0.813: IC1.15 85.72,69.85 R20.1
N$37
  Bottom 0.813: IC1.14 85.72,67.31 R21.1
N$38
  Bottom 0.813: IC1.13 85.72,64.77 R22.1
N$39
  Bottom 0.813: IC1.12 85.72,62.23 R23.1
N$40
  Bottom 0.813: IC1.11 85.72,59.69 R24.1
N$41
  Bottom 1.27: Q5.3 D3.A 99.38,59.05 97.23,56.91 SP1.-
N$42
  Bottom 1.93: U1.2 64.96,83.76 L2.P$1
  Bottom 2.184: D2.K 62.87,97.16 62.87,92.08 L2.P$1
N$43
  Bottom 0.406: C18.D- 89.53,8.18 89.53,7.62 90.17,6.99 92.08,6.99 93.34,8.26 93.34,10.16 92.71,10.79 92.08,10.79 91.44,11.43 91.44,13.97 92.08,14.61 92.08,26.04 92.71,26.67 U3.12
N$44
  Bottom 0.406: C18.D+ 90.17,13.97 91.44,15.24 91.44,28.57 92.08,29.21 U3.13
N$45
  Bottom 1.016: U3.11 C14.1
N$46
  Bottom 1.778: C18.P$7 C18.P$6 C16.2 97.79,6.35 96.52,7.62 R36.1
N$47
  Bottom 0.813: SV3.1 73.66,74.93 76.2,77.47 IC1.1
N$48
  Bottom 0.813: SV3.2 73.66,72.39 76.2,74.93 IC1.2
N$49
  Bottom 0.813: SV3.3 73.98,69.85 76.52,72.39 IC1.3
N$50
  Bottom 0.813: SV3.4 73.98,67.31 76.52,69.85 IC1.4
N$51
  Bottom 0.813: R37.1 LED9.A
N$52
  Bottom 1.016: R38.1 75.56,27.94 78.74,31.11 LED10.A
N$53
  Bottom 1.016: R39.1 78.11,26.04 78.74,26.67 LED11.A
N$54
  Bottom 0.813: R40.1 80.01,17.14 LED12.A
N$55
  Bottom 0.813: SV3.5 73.98,64.77 76.52,67.31 IC1.5
N$56
  Bottom 0.813: SV3.6 73.98,62.23 76.52,64.77 IC1.6
N$57
  Bottom 0.813: SV3.7 73.98,59.69 76.52,62.23 IC1.7
N$58
  Bottom 0.813: SV3.8 73.98,57.15 76.52,59.69 IC1.8
N$59
  Bottom 1.676: JP2.1 125.73,53.34 126.36,52.7 R27.2
N$60
  Bottom 1.676: JP1.2 130.18,53.34 129.54,52.7 R29.2
N$61
  Bottom 0.61: Q7.1 U2.1
N$62
  Bottom 0.61: Q7.2 149.22,27.94 149.22,29.21 149.86,29.84 149.86,32.38 148.59,33.66 U2.2
N$65
  Bottom 1.27: R28.2 104.14,61.59 Q5.2 105.41,61.59 R26.1
N$73  (via drill 1.3 pad 2.54)
  other vias: 116.84,5.08
N$74  (via drill 1.3 pad 2.54)
  other vias: 111.76,17.78
N$88
  Bottom 2.184: D1.A 54.44,87.95 J1.3
PA0
  Bottom 1.016: SV13.8 SV12.8 IC4.40
PA1
  Bottom 1.016: IC4.39 SV12.7 SV13.7
PA2
  Bottom 1.016: SV13.6 SV12.6 IC4.38
PA3
  Bottom 1.016: IC4.37 SV12.5 SV13.5
PA4
  Bottom 1.016: IC4.36 SV12.4 SV13.4
PA5
  Bottom 1.016: IC4.35 SV12.3 SV13.3
PA6
  Bottom 1.016: IC4.34 SV12.2 SV13.2
PA7
  Bottom 1.016: IC4.33 SV12.1 SV13.1
PB0
  Bottom 1.016: SV16.8 SV15.8 6.67,30.8 8.26,32.38 IC4.1
PB1
  Bottom 1.016: SV16.7 SV15.7 9.21,30.8 10.79,32.38 IC4.2
PB2
  Bottom 1.016: SV16.6 SV15.6 11.75,30.8 13.34,32.38 IC4.3
PB3
  Bottom 1.016: SV16.5 SV15.5 14.29,30.8 15.88,32.38 IC4.4
PB4
  Bottom 1.016: SV16.4 SV15.4 16.83,30.8 18.41,32.38 IC4.5
PB5
  Bottom 0.406: 67.63,39.69 67.63,42.23
  Bottom 0.61: SV16.3 19.37,19.05 21.91,16.83 65.09,16.83 67.63,19.37 67.63,39.69 | 67.63,42.23 SV10.4
  Bottom 1.016: SV16.3 SV15.3 19.37,30.16 20.95,31.75 IC4.6
PB6
  Bottom 0.61: SV16.2 21.91,18.73 22.54,18.1 64.77,18.1 66.04,19.37 SV10.1
  Bottom 1.016: SV16.2 SV15.2 21.91,30.8 23.5,32.38 IC4.7
PB7
  Bottom 0.406: 19.68,36.83 19.68,32.07 18.1,30.48 18.1,18.73
  Bottom 0.61: IC4.8 26.04,36.83 25.4,37.47 20.32,37.47 19.68,36.83 | 18.1,18.73 21.59,15.56 65.41,15.56 68.9,19.05 SV10.3
  Bottom 1.016: SV16.1 SV15.1 24.45,30.8 26.04,32.38 IC4.8
PC0
  Bottom 1.016: SV19.8 SV18.8 IC4.22
PC1
  Bottom 1.016: SV19.7 SV18.7 IC4.23
PC2
  Bottom 1.016: SV19.6 SV18.6 IC4.24
PC3
  Bottom 1.016: SV19.5 SV18.5 IC4.25
PC4
  Bottom 1.016: SV19.4 SV18.4 IC4.26
PC5
  Bottom 1.016: SV19.3 SV18.3 IC4.27
PC6
  Bottom 1.016: SV19.2 SV18.2 IC4.28
PC7
  Bottom 1.016: SV19.1 SV18.1 IC4.29
PD0  (via drill 0.6 pad 1.78)
  Top 1.016: v64.14,20.32 67.94,20.32 70.17,18.1 v75.56,18.1
  Bottom 0.406: U3.6 88.27,19.05 89.53,20.32 89.53,31.11 91.44,33.02 SV4.5
  Bottom 0.61: SV21.8 41.91,22.86 43.81,20.95 60.33,20.95 60.96,20.32 v64.14,20.32
  Bottom 1.016: IC4.14 41.27,33.02 41.91,32.38 SV20.8 SV21.8 | v75.56,18.1 77.47,18.1 79.69,20.32 83.82,20.32 85.09,19.05 U3.6
PD1  (via drill 0.6 pad 1.78)
  Top 1.016: v62.87,22.23 68.58,22.23 69.85,20.95 v75.56,20.95
  Bottom 0.406: U3.5 87.63,21.59 88.9,22.86 88.9,31.75 90.17,33.02 90.17,35.56 88.9,36.83
  Bottom 0.61: SV21.7 44.45,23.5 45.72,22.23 v62.87,22.23
  Bottom 1.016: SV21.7 SV20.7 44.45,31.75 43.81,32.38 IC4.15 | 88.9,36.83 SV4.4 | v75.56,20.95 78.11,20.95 79.38,22.23 84.45,22.23 85.09,21.59 U3.5
PD2
  Bottom 1.016: SV21.6 SV20.6 46.99,32.7 46.35,33.34 IC4.16
PD3
  Bottom 1.016: SV21.5 SV20.5 49.53,32.7 48.9,33.34 IC4.17
PD4
  Bottom 1.016: SV21.4 SV20.4 52.07,32.7 51.44,33.34 IC4.18
PD5
  Bottom 1.016: SV21.3 SV20.3 54.61,32.7 53.98,33.34 IC4.19
PD6
  Bottom 1.016: SV21.2 SV20.2 57.15,32.7 56.52,33.34 IC4.20
PD7
  Bottom 1.016: SV21.1 SV20.1 59.69,36.83 56.52,40.01 IC4.21
POTI
  Bottom 1.676: 111.76,17.78 R25.S 112.08,14.92 SV14.6
RESET
  Bottom 0.61: S1.2 70.17,17.58 70.17,36.83 71.44,38.1 SV10.5
  Bottom 0.813: IC4.9 28.57,37.47 26.67,39.37 8.26,39.37 6.35,37.47 R30.1 4.45,21.27 6.03,19.68 14.61,19.68 20,14.29 22.54,14.29 23.81,13.02 62.27,13.02 S1.2
  Bottom 1.27: IC4.9 C7.2 | S1.2 S1.1
SCL
  Top 0.61: R29.1 129.54,38.1 127.95,36.51 IC3.6
  Bottom 0.61: IC3.6 129.54,36.51 130.81,37.78 136.21,37.78 137.79,36.2 U2.6 142.24,36.2 148.27,42.23 149.22,42.23 149.86,42.86 149.86,46.99 149.22,47.62 IC2.2 | 122.87,28.89 119.7,28.89
  Bottom 0.813: SV14.2 122.87,25.08 123.83,26.04 123.83,27.94 122.87,28.89 | 119.7,28.89 118.43,30.16 118.43,37.15 119.06,37.78 SV11.5
  Bottom 1.016: SV11.5 122.87,37.78 124.14,36.51 IC3.6
SDA
  Bottom 0.61: IC2.1 147.32,42.55 143.51,38.73 U2.5 137.79,38.73 136.21,40.32 130.81,40.32 129.54,39.05 IC3.5 R27.1
  Bottom 0.813: SV14.1 119.38,27.62 117.16,29.84 117.16,38.73 118.75,40.32 SV11.4
  Bottom 1.016: SV11.4 123.19,40.32 124.46,39.05 IC3.5
SIGNAL
  Bottom 1.016: R26.2 114.94,45.4 SV11.2
SQW
  Bottom 0.61: U2.7 R32.1 135.89,32.7 124.78,32.7 122.24,30.16 SV11.8
T
  Bottom 0.61: SV2.1 95.89,86.68 100.33,91.12 R5.2
TOUT
  Bottom 0.406: IC2.3 145.41,50.16 141.6,46.35 138.11,46.35
  Bottom 0.61: SV11.3 121.6,43.18
  Bottom 0.813: 121.6,43.18 123.83,43.18 124.46,43.81 133.35,43.81 135.89,46.35 138.11,46.35
USB_SCL
  Bottom 1.016: U3.10 R41.1 99.06,23.5 SV4.8
USB_SDA
  Bottom 1.016: U3.9 99.06,19.05 99.69,19.68 R42.1 101.6,23.5 SV4.9
VBAT
  Bottom 0.61: U2.3 144.78,36.2 143.51,34.92 124.14,35.24 SV11.6
  Bottom 0.813: G1.+ 151.76,33.66 149.22,36.2 U2.3
VBUS
  Top 0.813: R41.2 93.98,14.61 84.45,14.61 83.19,13.34 C12.+
  Bottom 0.61: 87.63,35.56 87.63,40.64 85.72,42.55 D4.A | C15.1 87.63,34.92 | C12.+ 83.25,12.76 83.19,12.83
  Bottom 0.813: C18.VBUS 87.63,10.48 C17.2 | 83.25,12.7 C12.+ 83.12,12.7 | R39.2 81.28,36.83 SV4.1 D4.A | R41.2 R42.2
  Bottom 1.016: 83.25,12.7 C17.2 | R39.2 R38.2 75.56,31.75 73.03,29.21 73.03,17.14 R37.2 77.47,12.7 78.74,12.7 | 87.63,35.56 C15.1 | U3.1 86.36,33.66 87.63,34.92 | 78.74,12.7 83.12,12.7 | R40.2 78.74,12.7
WP
  Bottom 0.61: IC3.7 124.14,33.97 122.87,32.7 SV11.7
X
  Bottom 1.27: R33.1 134.32,18.75 ROT1.X
  Bottom 1.676: SV14.3 125.09,22.54 129.86,17.78 R33.1
Z
  Bottom 0.61: SV2.3 97.16,91.76 97.79,92.39 97.79,94.93 99.06,96.2 113.98,96.2 114.94,95.25 124.78,95.25 125.73,94.3 R7.2

### Text on the board
Bottom: Rev.6 | BBS TGHS
tNames: High | +5V | Low | GND | GND
Document: Digits | E | Z | H | GND | T | BBS TGHS | Rev.6 | LED | f | +12V | g | b | a | SDA | SCL | c | 0 | 1 | 2 | 3 | 4 | 5 | 6 | 7 | 7 | 6 | 5 | 4 | 3 | 2 | 1 | 0 | Tausender | Hunderter | Zehner | Einer | dp | d | JP2 | JP1 | e | Temperatursensor | Segmente | Port A | Port C | +5V | ISP-Programmer | Lautspr. | DS1621 | TOUT | ATmega32 | GP0 | GP1 | URX | UTX | GP2 | GND | USCL | USDA | GP3 | SDA | 24AA128P | SCL | VUSB | VBAT | WP | Port B | Port D | SQW | UTX | DS1307 | SDA | URX | SCL | EEPROM | Uhr | X | 0 | 1 | 2 | 3 | 4 | 5 | 6 | 7 | 0 | 1 | 2 | 3 | 4 | 5 | 6 | 7 | B | I2C | A | Poti | Tasten | RXD | TXD | RESET | USB | Potentiometer | Inkrementalgeber